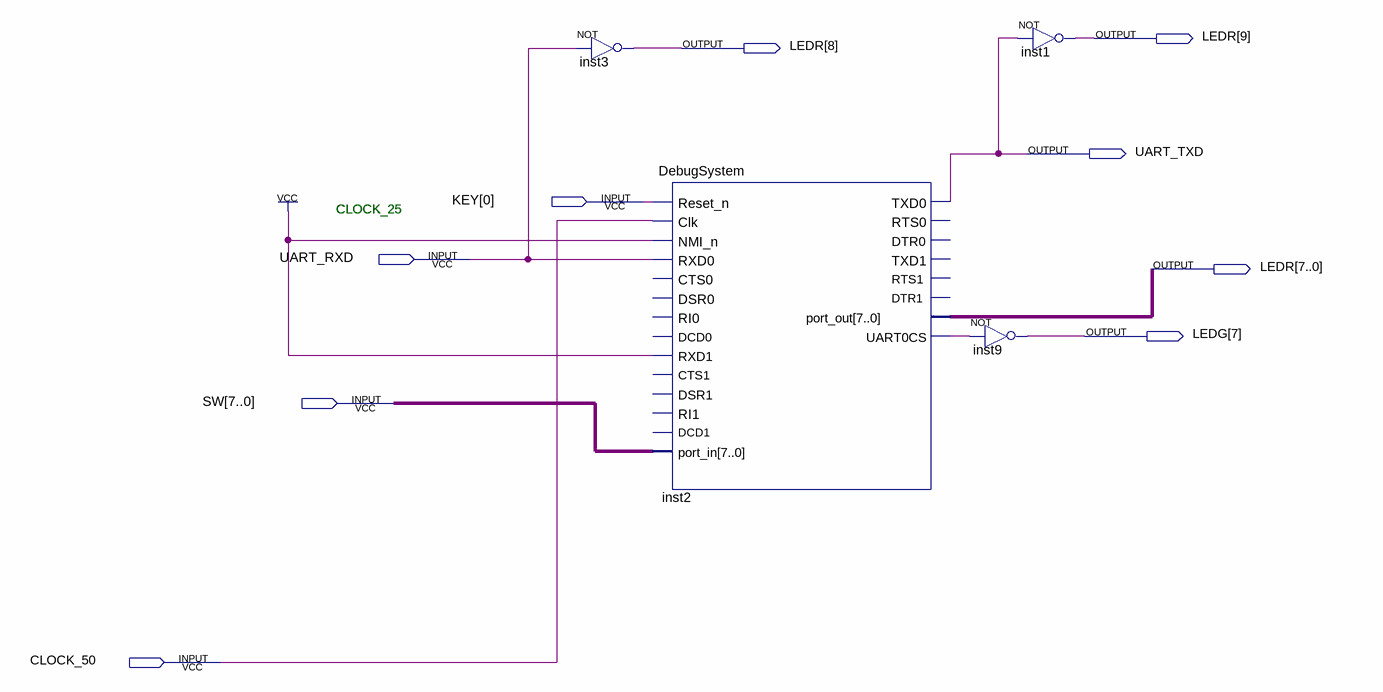
[diagram p0: schematic sheet]
// Quartus schematic DebugSystem-de1.bdf as structural Verilog: 4 symbols, 9 pins
module \DebugSystem-de1  (
  input  [0:0] KEY,
  input  UART_RXD,
  input  [7:0] SW,
  input  CLOCK_50,
  output [9:0] LEDR,
  output UART_TXD,
  output [7:7] LEDG
);

  wire inst2_uart0cs;

  not inst3 (LEDR[8], UART_RXD);
  DebugSystem inst2 (
    .Reset_n(KEY[0]), .Clk(CLOCK_50), .NMI_n(1'b1), .RXD0(UART_RXD), .RXD1(1'b1), .port_in(SW),
    .TXD0(UART_TXD), .port_out(LEDR[7:0]), .UART0CS(inst2_uart0cs));  // open: CTS0, DSR0, RI0, DCD0, CTS1, DSR1, RI1, DCD1, RTS0, DTR0, TXD1, RTS1, DTR1
  not inst9 (LEDG[7], inst2_uart0cs);
  not inst1 (LEDR[9], UART_TXD);

  // Notes on the sheet:
  //   CLOCK_25
  //   CLOCK_25
  //   CLOCK_25
endmodule
